# Altium schematic sheet Sheet1.SchDoc
size A4
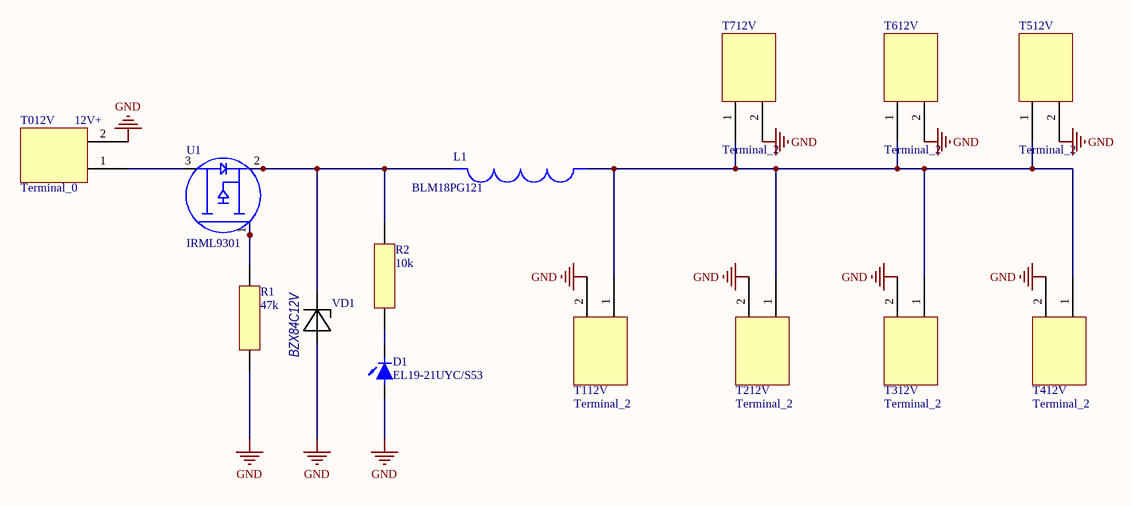
[diagram p0: Sheet1.SchDoc]

## Parts
D1  EL19-21UYC/S53  [0603_LED]
L1  BLM18PG121  [0603ind]
R1  47k  [0603_RES]
R2  10k  [0603_RES]
T012V  Terminal_0  [TERMINAL_2_3.5]
T112V  Terminal_2  [TERMINAL_2_3.5]
T212V  Terminal_2  [TERMINAL_2_3.5]
T312V  Terminal_2  [TERMINAL_2_3.5]
T412V  Terminal_2  [TERMINAL_2_3.5]
T512V  Terminal_2  [TERMINAL_2_3.5]
T612V  Terminal_2  [TERMINAL_2_3.5]
T712V  Terminal_2  [TERMINAL_2_3.5]
U1  IRML9301  [MICRO3_NORM]
VD1  BZX84C12V  [SOT23]

## Nets
GND: D1.1(A) R1.2(V-) T012V.2 T112V.2 T212V.2 T312V.2 T412V.2 T512V.2 T612V.2 T712V.2 VD1.1
NetD1_2: D1.2(K) R2.1(V+)
NetL1_1: L1.1 T112V.1 T212V.1 T312V.1 T412V.1 T512V.1 T612V.1 T712V.1
NetL1_2: L1.2 R2.2(V-) U1.2 VD1.2
NetR1_1: R1.1(V+) U1.1
NetT012V_1: T012V.1 U1.3

## Notes on the sheet
- (near T012V) 12V+

## Library data of the parts
D1 = LED: Typical INFRARED GaAs LED; Published: 8-Jun-2000; LatestRevisionDate: 08-Jul-2005; LatestRevisionNote: Mech Layer 1 removed.; PackageReference: LED-0; Publisher: Altium Limited
L1 = L: Inductor; ManufacturerPartNumber: BLM18PG121TN1D; ManufacturerName: Murata; Current: 3000mA; Tolerance: *; Value: BLM18PG121
R1 R2 = R: RC0603FR-0747kL
T012V = Terminal_2
U1 = IRML5203: IRLML9301TRPBF
VD1 = DIODE_STAB_BZX84_GOST: DIODE ZENER 12V 350MW SOT23-3; Manufacturer: Fairchild Semiconductor; Voltage - Forward (Vf) (Max) @ If: 900mV @ 10mA; Current - Reverse Leakage @ Vr: 100nA @ 8V; Tolerance: ±5%; Impedance (Max) (Zzt): 25 Ohm; ManufacturerPartNumber: *; Value: *; Part Number: BZX84C12; Manufacturer Part Number: BZX84C12; Supplier 1: Digi-Key; Supplier Part Number 1: BZX84C12FSTR-ND; RoHS: RoHS Compliant; Category: Discrete Semiconductor Products; Stock 1: 12000; Pricing 1: 3000=0.0357, 6000=0.0322, 15000=0.028 (USD); Package / Case: TO-236-3, SC-59, SOT-23-3; Supplier Device Package: SOT-23-3 (TO-236); Packaging: Tape & Reel (TR); ComponentLink1URL: http://www.fairchildsemi.com/ds/BZ/BZX84C10.pdf; ComponentLink1Description: http://www.fairchildsemi.com/ds/BZ/BZX84C10.pdf; Mounting Type: Surface Mount; Voltage - Zener (Nom) (Vz): 12V; Power - Max: 350mW; Operating Temperature: -55°C ~ 150°C